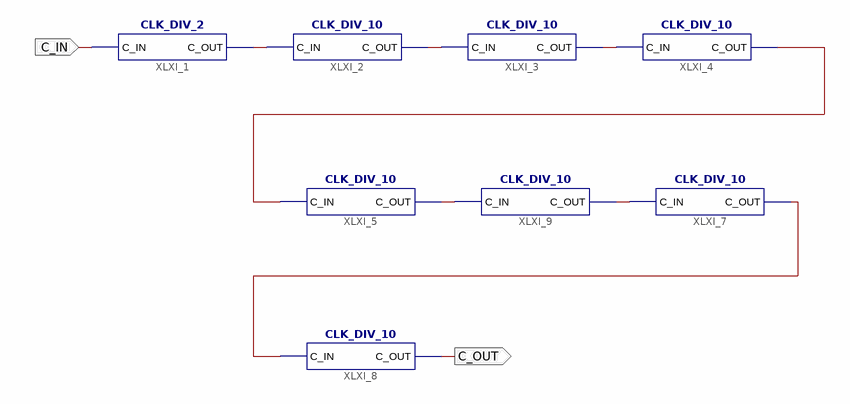
[diagram p0: schematic sheet 1]
// Xilinx ISE schematic CLK_DIV_20M.sch (spartan6) as structural Verilog: 8 symbols, 2 ports
module CLK_DIV_20M (
  input  C_IN,
  output C_OUT
);

  wire XLXN_1, XLXN_2, XLXN_3, XLXN_6, XLXN_7, XLXN_8, XLXN_9;

  CLK_DIV_2 XLXI_1 (.C_IN(C_IN), .C_OUT(XLXN_1));
  CLK_DIV_10 XLXI_2 (.C_IN(XLXN_1), .C_OUT(XLXN_2));
  CLK_DIV_10 XLXI_3 (.C_IN(XLXN_2), .C_OUT(XLXN_3));
  CLK_DIV_10 XLXI_4 (.C_IN(XLXN_3), .C_OUT(XLXN_6));
  CLK_DIV_10 XLXI_7 (.C_IN(XLXN_9), .C_OUT(XLXN_7));
  CLK_DIV_10 XLXI_8 (.C_IN(XLXN_7), .C_OUT(C_OUT));
  CLK_DIV_10 XLXI_5 (.C_IN(XLXN_6), .C_OUT(XLXN_8));
  CLK_DIV_10 XLXI_9 (.C_IN(XLXN_8), .C_OUT(XLXN_9));
endmodule
